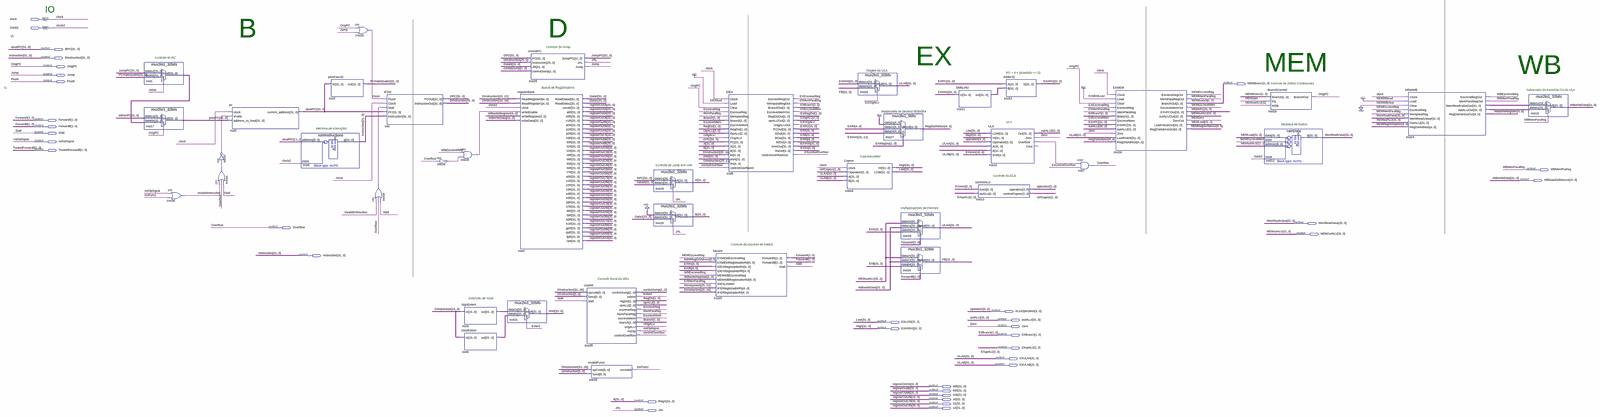
[diagram p0: schematic sheet, whole]
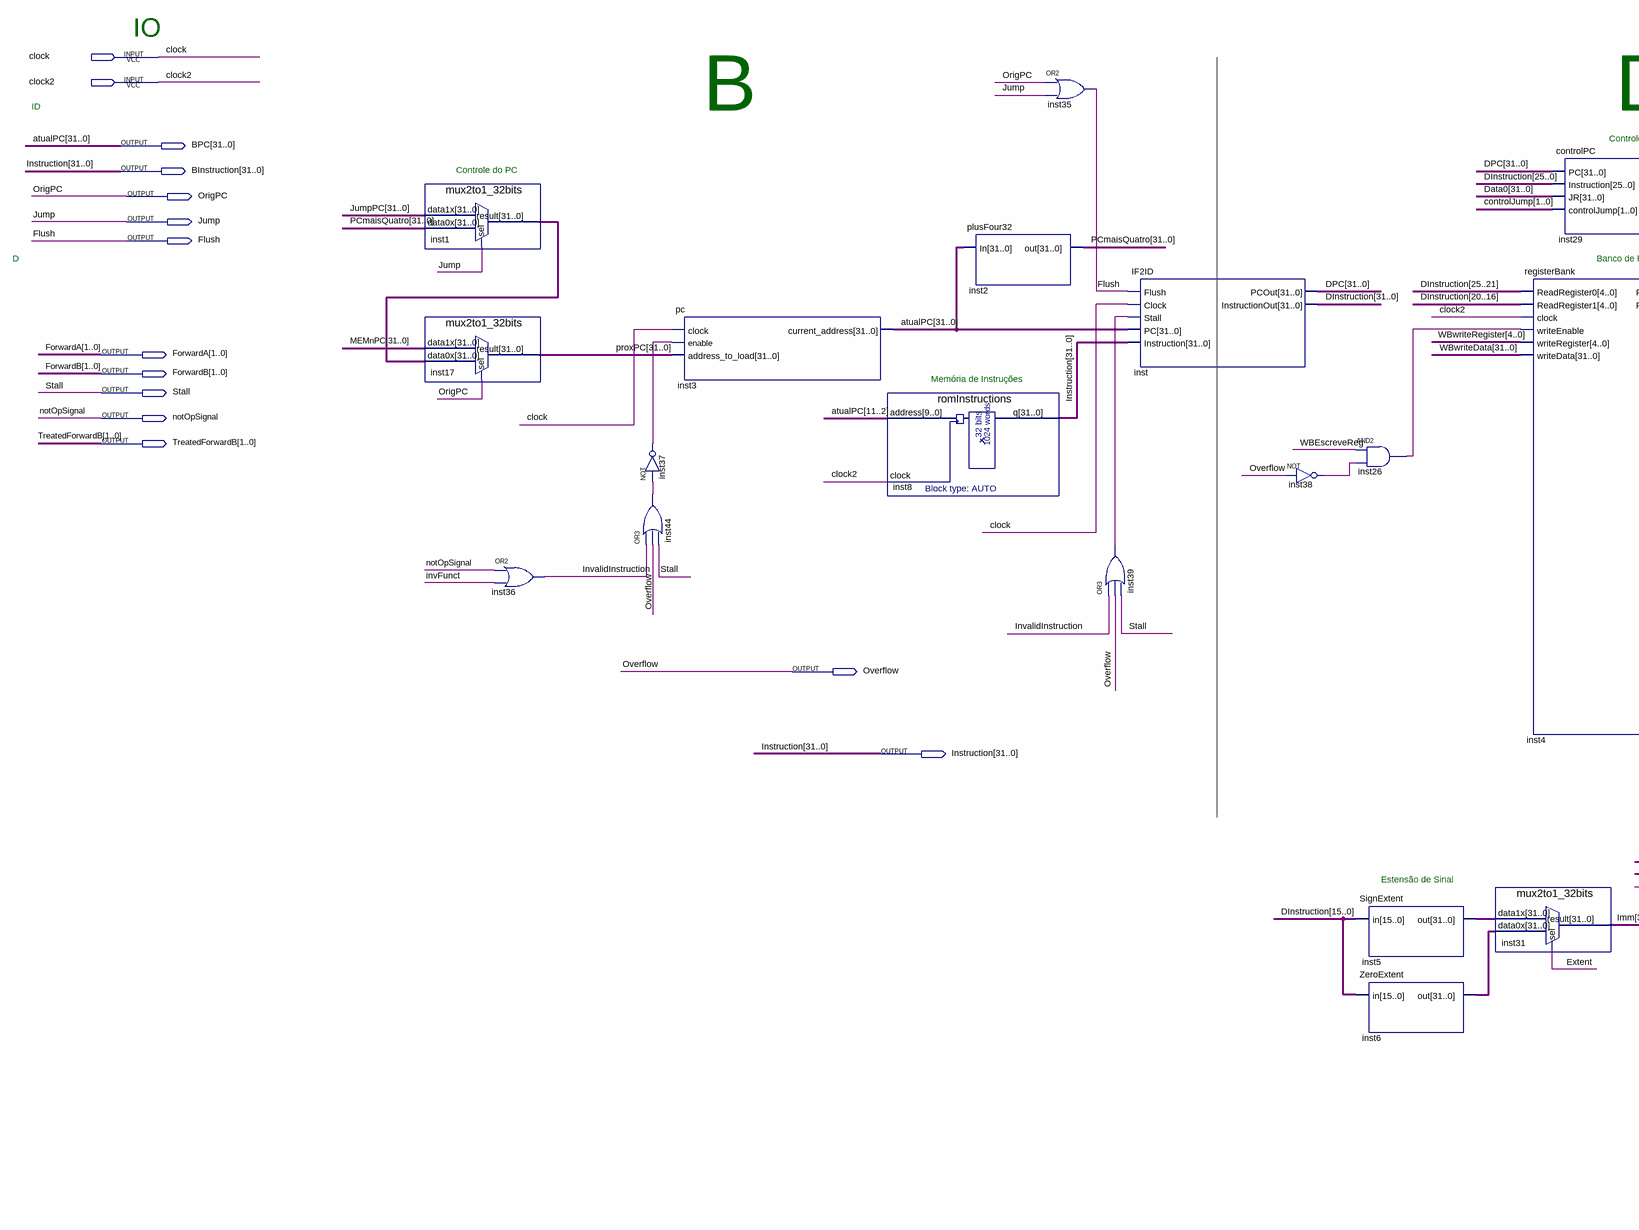
[diagram p1: schematic sheet, left part]
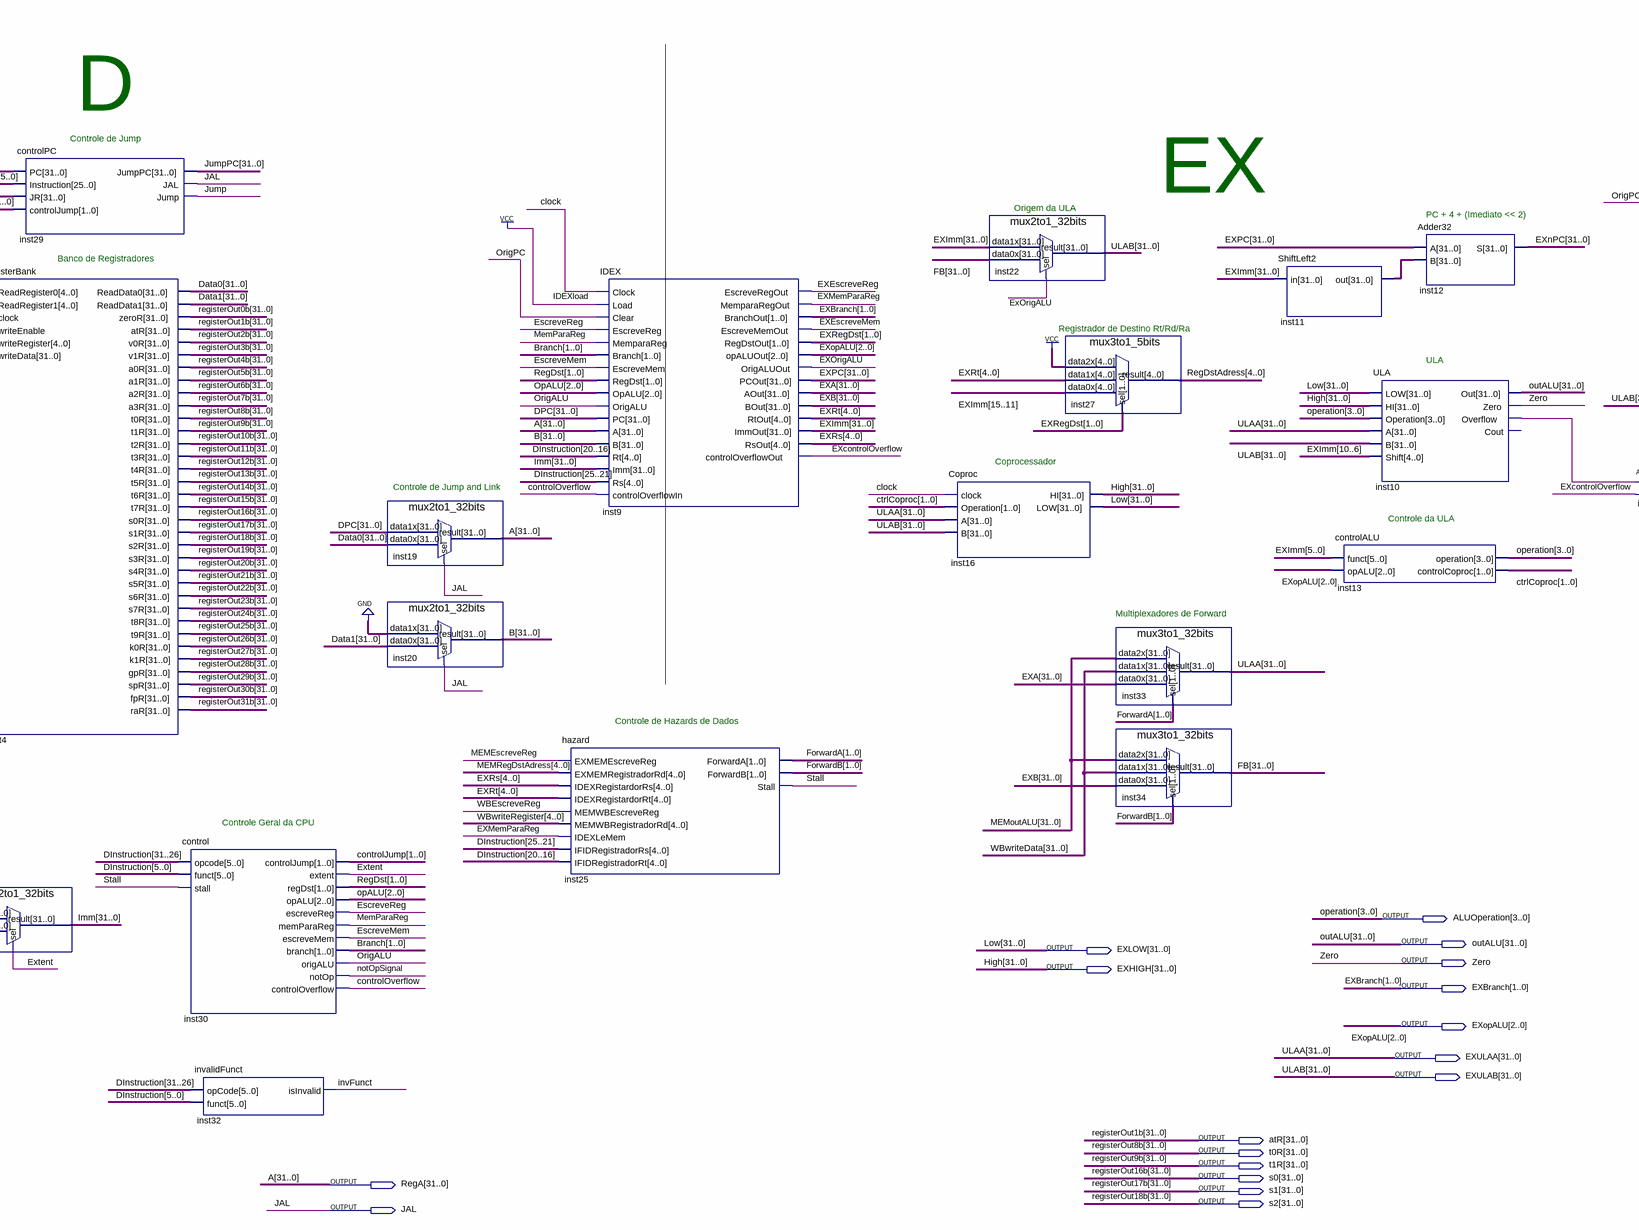
[diagram p2: schematic sheet, centre part]
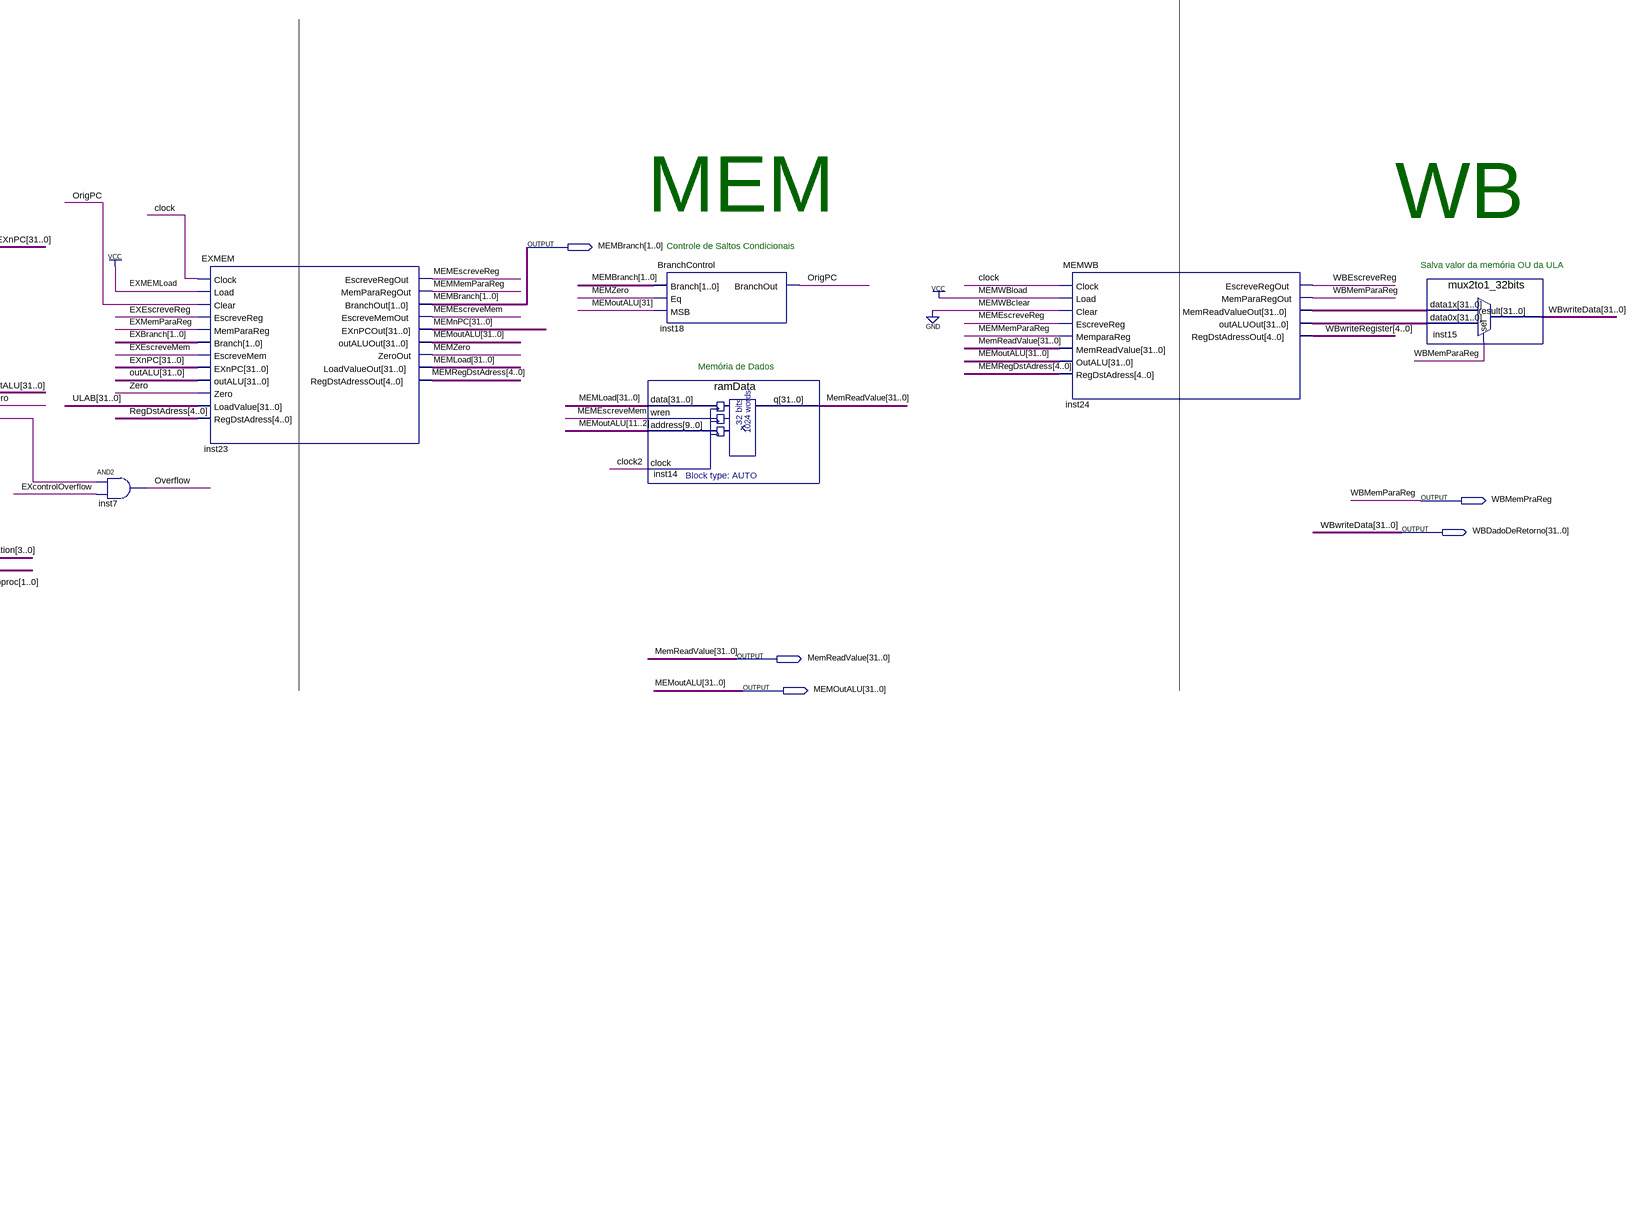
[diagram p3: schematic sheet, right part]
// Quartus schematic PipelineInit.bdf as structural Verilog: 39 symbols, 36 pins
module PipelineInit (
  input  clock,
  input  clock2,
  output [31:0] BPC,
  output [31:0] BInstruction,
  output OrigPC,
  output Jump,
  output Flush,
  output [1:0] MEMBranch,
  output [1:0] ForwardA,
  output [1:0] ForwardB,
  output Stall,
  output notOpSignal,
  output [1:0] TreatedForwardB,
  output WBMemPraReg,
  output [31:0] WBDadoDeRetorno,
  output [31:0] MemReadValue,
  output Overflow,
  output [31:0] MEMOutALU,
  output [31:0] Instruction,
  output [3:0] ALUOperation,
  output [31:0] outALU,
  output [31:0] EXLOW,
  output Zero,
  output [31:0] EXHIGH,
  output [1:0] EXBranch,
  output [2:0] EXopALU,
  output [31:0] EXULAA,
  output [31:0] EXULAB,
  output [31:0] atR,
  output [31:0] t0R,
  output [31:0] t1R,
  output [31:0] s0,
  output [31:0] RegA,
  output [31:0] s1,
  output [31:0] s2,
  output JAL
);

  wire controlOverflow, EscreveMem, EscreveReg, EXcontrolOverflow, EXEscreveMem, EXEscreveReg, EXMemParaReg,
       ExOrigALU, Extent, inst10_overflow, inst26_out, inst37_out, inst38_out, inst39_out, inst44_out,
       InvalidInstruction, invFunct, MEMEscreveMem, MEMEscreveReg, MEMMemParaReg, MemParaReg, MEMZero,
       OrigALU, WBEscreveReg;
  wire [1:0] Branch, controlJump, ctrlCoproc, EXRegDst, RegDst;
  wire [2:0] OpALU;
  wire [4:0] EXRs, EXRt, MEMRegDstAdress, RegDstAdress, WBwriteRegister;
  wire [31:0] B, Data0, Data1, DInstruction, DPC, EXA, EXB, EXImm, EXnPC, EXPC, FB, Imm, inst1_result,
       inst5_out, inst6_out, inst11_out, inst24_memreadvalueout, inst24_outaluout, JumpPC, MEMLoad, MEMnPC,
       PCmaisQuatro, proxPC, registerOut0b, registerOut2b, registerOut3b, registerOut4b, registerOut5b,
       registerOut6b, registerOut7b, registerOut10b, registerOut11b, registerOut12b, registerOut13b,
       registerOut14b, registerOut15b, registerOut19b, registerOut20b, registerOut21b, registerOut22b,
       registerOut23b, registerOut24b, registerOut25b, registerOut26b, registerOut27b, registerOut28b,
       registerOut29b, registerOut30b, registerOut31b;

  mux2to1_32bits inst1 (.data1x(JumpPC), .data0x(PCmaisQuatro), .sel(Jump), .result(inst1_result));
  mux2to1_32bits inst17 (.data1x(MEMnPC), .data0x(inst1_result), .sel(OrigPC), .result(proxPC));
  or inst36 (InvalidInstruction, notOpSignal, invFunct);
  not inst37 (inst37_out, inst44_out);
  or inst44 (inst44_out, InvalidInstruction, Overflow, Stall);
  pc inst3 (.clock(clock), .enable(inst37_out), .address_to_load(proxPC), .current_address(BPC));
  romInstructions inst8 (.address(BPC[11:2]), .clock(clock2), .q(BInstruction));
  plusFour32 inst2 (.In(BPC), .out(PCmaisQuatro));
  or inst35 (Flush, OrigPC, Jump);
  or inst39 (inst39_out, InvalidInstruction, Overflow, Stall);
  IF2ID inst (
    .Flush(Flush), .Clock(clock), .Stall(inst39_out), .PC(BPC), .Instruction(BInstruction), .PCOut(DPC),
    .InstructionOut(DInstruction));
  not inst38 (inst38_out, Overflow);
  and inst26 (inst26_out, WBEscreveReg, inst38_out);
  SignExtent inst5 (.in(DInstruction[15:0]), .out(inst5_out));
  ZeroExtent inst6 (.in(DInstruction[15:0]), .out(inst6_out));
  registerBank inst4 (
    .ReadRegister0(DInstruction[25:21]), .ReadRegister1(DInstruction[20:16]), .clock(clock2),
    .writeEnable(inst26_out), .writeRegister(WBwriteRegister), .writeData(WBDadoDeRetorno),
    .ReadData0(Data0), .ReadData1(Data1), .zeroR(registerOut0b), .atR(atR), .v0R(registerOut2b),
    .v1R(registerOut3b), .a0R(registerOut4b), .a1R(registerOut5b), .a2R(registerOut6b), .a3R(registerOut7b),
    .t0R(t0R), .t1R(t1R), .t2R(registerOut10b), .t3R(registerOut11b), .t4R(registerOut12b),
    .t5R(registerOut13b), .t6R(registerOut14b), .t7R(registerOut15b), .s0R(s0), .s1R(s1), .s2R(s2),
    .s3R(registerOut19b), .s4R(registerOut20b), .s5R(registerOut21b), .s6R(registerOut22b),
    .s7R(registerOut23b), .t8R(registerOut24b), .t9R(registerOut25b), .k0R(registerOut26b),
    .k1R(registerOut27b), .gpR(registerOut28b), .spR(registerOut29b), .fpR(registerOut30b),
    .raR(registerOut31b));
  mux2to1_32bits inst31 (.data1x(inst5_out), .data0x(inst6_out), .sel(Extent), .result(Imm));
  controlPC inst29 (
    .PC(DPC), .Instruction(DInstruction[25:0]), .JR(Data0), .controlJump(controlJump), .JumpPC(JumpPC),
    .JAL(JAL), .Jump(Jump));
  control inst30 (
    .opcode(DInstruction[31:26]), .funct(DInstruction[5:0]), .stall(Stall), .controlJump(controlJump),
    .extent(Extent), .regDst(RegDst), .opALU(OpALU), .escreveReg(EscreveReg), .memParaReg(MemParaReg),
    .escreveMem(EscreveMem), .branch(Branch), .origALU(OrigALU), .notOp(notOpSignal),
    .controlOverflow(controlOverflow));
  invalidFunct inst32 (.opCode(DInstruction[31:26]), .funct(DInstruction[5:0]), .isInvalid(invFunct));
  mux2to1_32bits inst19 (.data1x(DPC), .data0x(Data0), .sel(JAL), .result(RegA));
  mux2to1_32bits inst20 (.data1x({32{1'b0}}), .data0x(Data1), .sel(JAL), .result(B));
  IDEX inst9 (
    .Clock(clock), .Load(1'b1), .Clear(OrigPC), .EscreveReg(EscreveReg), .MemparaReg(MemParaReg),
    .Branch(Branch), .EscreveMem(EscreveMem), .RegDst(RegDst), .OpALU(OpALU), .OrigALU(OrigALU), .PC(DPC),
    .A(RegA), .B(B), .Rt(DInstruction[20:16]), .Imm(Imm), .Rs(DInstruction[25:21]),
    .controlOverflowIn(controlOverflow), .EscreveRegOut(EXEscreveReg), .MemparaRegOut(EXMemParaReg),
    .BranchOut(EXBranch), .EscreveMemOut(EXEscreveMem), .RegDstOut(EXRegDst), .opALUOut(EXopALU),
    .OrigALUOut(ExOrigALU), .PCOut(EXPC), .AOut(EXA), .BOut(EXB), .RtOut(EXRt), .ImmOut(EXImm), .RsOut(EXRs),
    .controlOverflowOut(EXcontrolOverflow));
  hazard inst25 (
    .EXMEMEscreveReg(MEMEscreveReg), .EXMEMRegistradorRd(MEMRegDstAdress), .IDEXRegistardorRs(EXRs),
    .IDEXRegistardorRt(EXRt), .MEMWBEscreveReg(WBEscreveReg), .MEMWBRegistradorRd(WBwriteRegister),
    .IDEXLeMem(EXMemParaReg), .IFIDRegistradorRs(DInstruction[25:21]),
    .IFIDRegistradorRt(DInstruction[20:16]), .ForwardA(ForwardA), .ForwardB(ForwardB), .Stall(Stall));
  Coproc inst16 (.clock(clock), .Operation(ctrlCoproc), .A(EXULAA), .B(EXULAB), .HI(EXHIGH), .LOW(EXLOW));
  mux2to1_32bits inst22 (.data1x(EXImm), .data0x(FB), .sel(ExOrigALU), .result(EXULAB));
  mux3to1_5bits inst27 (
    .data2x({5{1'b1}}), .data1x(EXRt), .data0x(EXImm[15:11]), .sel(EXRegDst), .result(RegDstAdress));
  mux3to1_32bits inst33 (.data2x(MEMOutALU), .data1x(WBDadoDeRetorno), .data0x(EXA), .sel(ForwardA), .result(EXULAA));
  mux3to1_32bits inst34 (.data2x(MEMOutALU), .data1x(WBDadoDeRetorno), .data0x(EXB), .sel(ForwardB), .result(FB));
  ShiftLeft2 inst11 (.in(EXImm), .out(inst11_out));
  controlALU inst13 (.funct(EXImm[5:0]), .opALU(EXopALU), .operation(ALUOperation), .controlCoproc(ctrlCoproc));
  ULA inst10 (
    .LOW(EXLOW), .HI(EXHIGH), .Operation(ALUOperation), .A(EXULAA), .B(EXULAB), .Shift(EXImm[10:6]),
    .Out(outALU), .Zero(Zero), .Overflow(inst10_overflow));  // open: Cout
  Adder32 inst12 (.A(EXPC), .B(inst11_out), .S(EXnPC));
  and inst7 (Overflow, inst10_overflow, EXcontrolOverflow);
  EXMEM inst23 (
    .Clock(clock), .Load(1'b1), .Clear(OrigPC), .EscreveReg(EXEscreveReg), .MemParaReg(EXMemParaReg),
    .Branch(EXBranch), .EscreveMem(EXEscreveMem), .EXnPC(EXnPC), .outALU(outALU), .Zero(Zero),
    .LoadValue(EXULAB), .RegDstAdress(RegDstAdress), .EscreveRegOut(MEMEscreveReg),
    .MemParaRegOut(MEMMemParaReg), .BranchOut(MEMBranch), .EscreveMemOut(MEMEscreveMem), .EXnPCOut(MEMnPC),
    .outALUOut(MEMOutALU), .ZeroOut(MEMZero), .LoadValueOut(MEMLoad), .RegDstAdressOut(MEMRegDstAdress));
  BranchControl inst18 (.Branch(MEMBranch), .Eq(MEMZero), .MSB(MEMOutALU[31]), .BranchOut(OrigPC));
  ramData inst14 (.data(MEMLoad), .wren(MEMEscreveMem), .address(MEMOutALU[11:2]), .clock(clock2), .q(MemReadValue));
  MEMWB inst24 (
    .Clock(clock), .Load(1'b1), .Clear(1'b0), .EscreveReg(MEMEscreveReg), .MemparaReg(MEMMemParaReg),
    .MemReadValue(MemReadValue), .OutALU(MEMOutALU), .RegDstAdress(MEMRegDstAdress),
    .EscreveRegOut(WBEscreveReg), .MemParaRegOut(WBMemPraReg), .MemReadValueOut(inst24_memreadvalueout),
    .outALUOut(inst24_outaluout), .RegDstAdressOut(WBwriteRegister));
  mux2to1_32bits inst15 (
    .data1x(inst24_memreadvalueout), .data0x(inst24_outaluout), .sel(WBMemPraReg), .result(WBDadoDeRetorno));

  assign Instruction = BInstruction;

  // Other names for the same wires on the sheet: A[31:0] = RegA; atualPC[31:0] = BPC; High[31:0] = EXHIGH;
  //   Low[31:0] = EXLOW; operation[3:0] = ALUOperation; registerOut1b[31:0] = atR; registerOut8b[31:0] = t0R;
  //   registerOut9b[31:0] = t1R; registerOut16b[31:0] = s0; registerOut17b[31:0] = s1; registerOut18b[31:0] = s2;
  //   ULAA[31:0] = EXULAA; ULAB[31:0] = EXULAB; WBMemParaReg = WBMemPraReg; WBwriteData[31:0] = WBDadoDeRetorno

  // Notes on the sheet:
  //   IO
  //   B
  //   D
  //   ID
  //   EX
  //   Controle de Jump
  //   MEM
  //   WB
  //   Controle do PC
  //   Origem da ULA
  //   PC + 4 + (Imediato << 2)
  //   Controle de Saltos Condicionais
  //   D
  //   Banco de Registradores
  //   Salva valor da memória OU da ULA
  //   Registrador de Destino Rt/Rd/Ra
  //   ULA
  //   Memória de Dados
  //   Memória de Instruções
  //   Coprocessador
  //   Controle de Jump and Link
  //   Controle da ULA
  //   Multiplexadores de Forward
  //   Controle de Hazards de Dados
  //   Controle Geral da CPU
  //   Estensão de Sinal
endmodule
